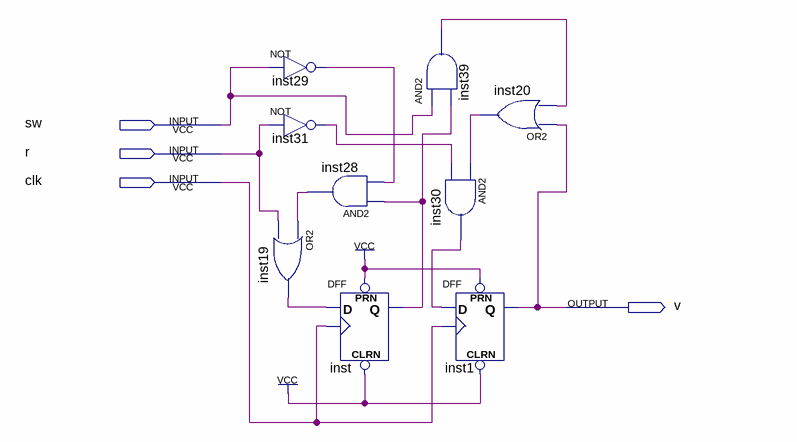
[diagram p0: schematic sheet]
// Quartus schematic sword.bdf as structural Verilog: 9 symbols, 4 pins
module sword (
  input  sw,
  input  r,
  input  clk,
  output v
);

  wire inst19_out, inst20_out, inst28_out, inst29_out, inst30_out, inst31_out, inst39_out, inst_q;

  not inst29 (inst29_out, sw);
  not inst31 (inst31_out, r);
  or inst19 (inst19_out, inst28_out, r);
  and inst28 (inst28_out, inst_q, inst29_out);
  DFF inst (.CLRN(1'b1), .CLK(clk), .D(inst19_out), .PRN(1'b1), .Q(inst_q));
  and inst39 (inst39_out, sw, inst_q);
  and inst30 (inst30_out, inst20_out, inst31_out);
  DFF inst1 (.CLRN(1'b1), .CLK(clk), .D(inst30_out), .PRN(1'b1), .Q(v));
  or inst20 (inst20_out, v, inst39_out);
endmodule
